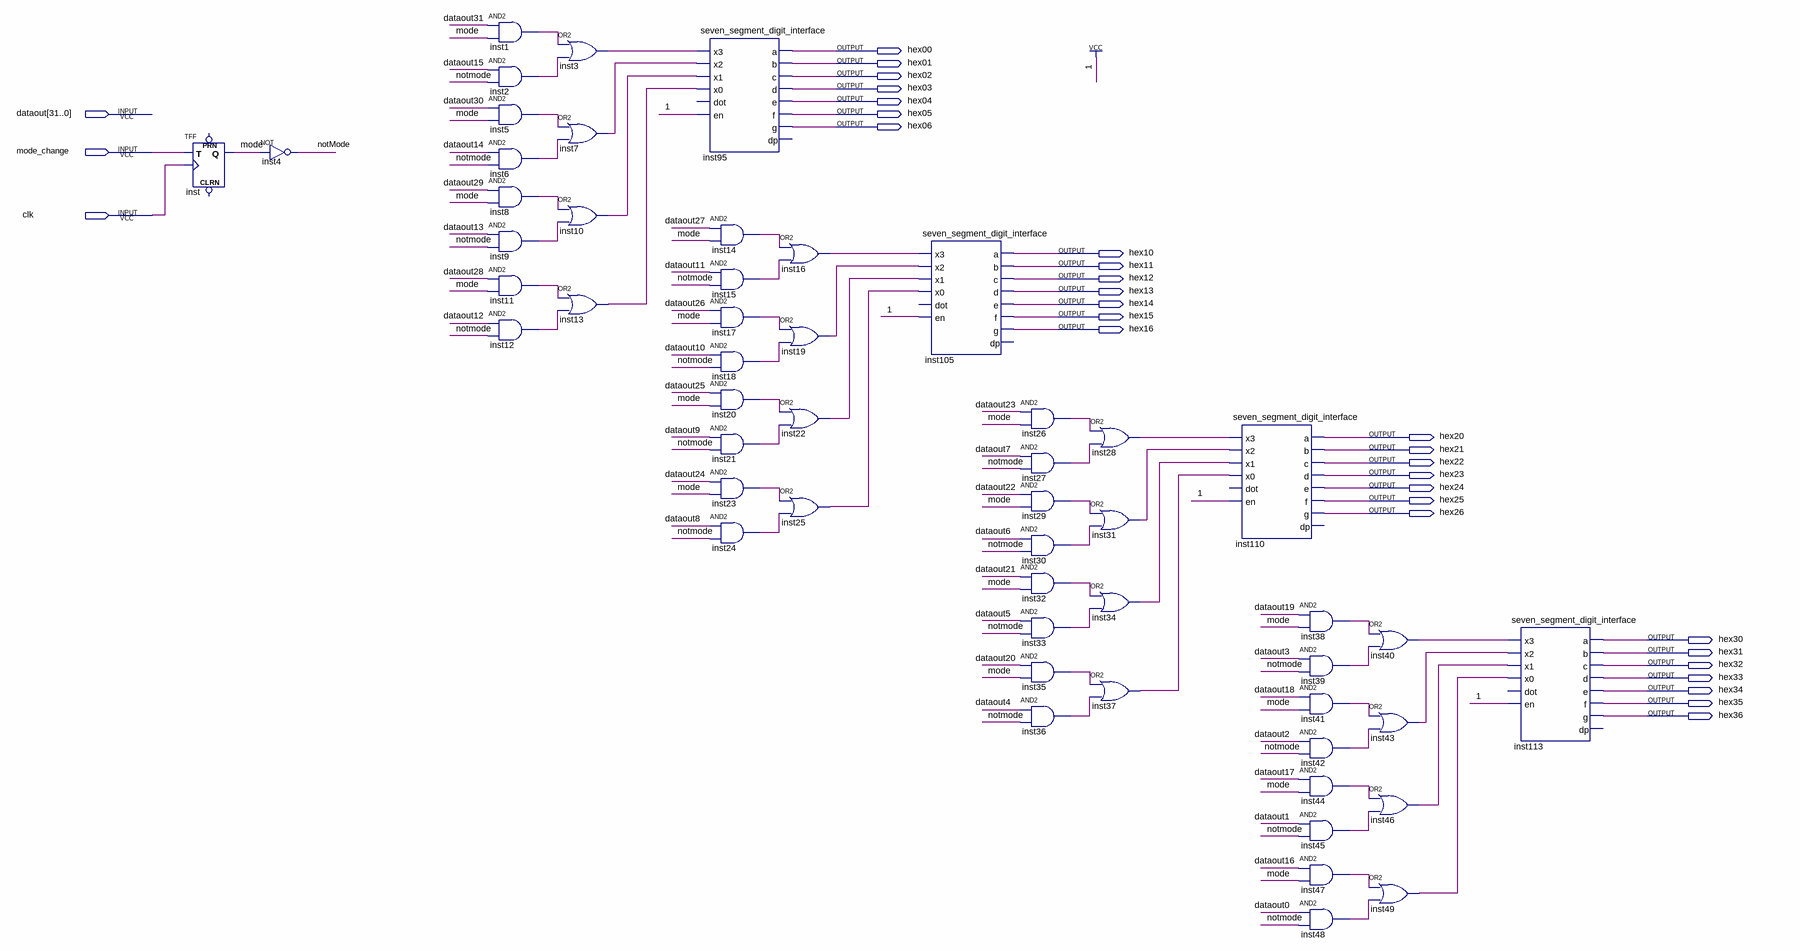
[diagram p0: schematic sheet]
// Quartus schematic Print.bdf as structural Verilog: 54 symbols, 31 pins
module Print (
  input  [31:0] dataout,
  input  mode_change,
  input  clk,
  output hex00,
  output hex01,
  output hex02,
  output hex03,
  output hex04,
  output hex05,
  output hex06,
  output hex10,
  output hex11,
  output hex12,
  output hex13,
  output hex14,
  output hex15,
  output hex16,
  output hex20,
  output hex21,
  output hex22,
  output hex23,
  output hex24,
  output hex25,
  output hex26,
  output hex30,
  output hex31,
  output hex32,
  output hex33,
  output hex34,
  output hex35,
  output hex36
);

  wire inst1_out, inst2_out, inst3_out, inst5_out, inst6_out, inst7_out, inst8_out, inst9_out, inst10_out,
       inst11_out, inst12_out, inst13_out, inst14_out, inst15_out, inst16_out, inst17_out, inst18_out,
       inst19_out, inst20_out, inst21_out, inst22_out, inst23_out, inst24_out, inst25_out, inst26_out,
       inst27_out, inst28_out, inst29_out, inst30_out, inst31_out, inst32_out, inst33_out, inst34_out,
       inst35_out, inst36_out, inst37_out, inst38_out, inst39_out, inst40_out, inst41_out, inst42_out,
       inst43_out, inst44_out, inst45_out, inst46_out, inst47_out, inst48_out, inst49_out, mode, notMode;

  TFF inst (.T(mode_change), .CLK(clk), .Q(mode));  // open: PRN, CLRN
  not inst4 (notMode, mode);
  and inst1 (inst1_out, dataout[31], mode);
  and inst2 (inst2_out, dataout[15], notMode);
  and inst5 (inst5_out, dataout[30], mode);
  and inst6 (inst6_out, dataout[14], notMode);
  and inst8 (inst8_out, dataout[29], mode);
  and inst9 (inst9_out, dataout[13], notMode);
  and inst11 (inst11_out, dataout[28], mode);
  and inst12 (inst12_out, dataout[12], notMode);
  or inst3 (inst3_out, inst1_out, inst2_out);
  or inst7 (inst7_out, inst5_out, inst6_out);
  or inst10 (inst10_out, inst8_out, inst9_out);
  or inst13 (inst13_out, inst11_out, inst12_out);
  seven_segment_digit_interface inst95 (
    .x3(inst3_out), .x2(inst7_out), .x1(inst10_out), .x0(inst13_out), .en(1'b1), .a(hex00), .b(hex01),
    .c(hex02), .d(hex03), .e(hex04), .f(hex05), .g(hex06));  // open: dot, dp
  and inst14 (inst14_out, dataout[27], mode);
  and inst15 (inst15_out, dataout[11], notMode);
  and inst17 (inst17_out, dataout[26], mode);
  and inst18 (inst18_out, dataout[10], notMode);
  and inst20 (inst20_out, dataout[25], mode);
  and inst21 (inst21_out, dataout[9], notMode);
  and inst23 (inst23_out, dataout[24], mode);
  and inst24 (inst24_out, dataout[8], notMode);
  or inst16 (inst16_out, inst14_out, inst15_out);
  or inst19 (inst19_out, inst17_out, inst18_out);
  or inst22 (inst22_out, inst20_out, inst21_out);
  or inst25 (inst25_out, inst23_out, inst24_out);
  seven_segment_digit_interface inst105 (
    .x3(inst16_out), .x2(inst19_out), .x1(inst22_out), .x0(inst25_out), .en(1'b1), .a(hex10), .b(hex11),
    .c(hex12), .d(hex13), .e(hex14), .f(hex15), .g(hex16));  // open: dot, dp
  and inst26 (inst26_out, dataout[23], mode);
  and inst27 (inst27_out, dataout[7], notMode);
  and inst29 (inst29_out, dataout[22], mode);
  and inst30 (inst30_out, dataout[6], notMode);
  and inst32 (inst32_out, dataout[21], mode);
  and inst33 (inst33_out, dataout[5], notMode);
  and inst35 (inst35_out, dataout[20], mode);
  and inst36 (inst36_out, dataout[4], notMode);
  or inst28 (inst28_out, inst26_out, inst27_out);
  or inst31 (inst31_out, inst29_out, inst30_out);
  or inst34 (inst34_out, inst32_out, inst33_out);
  or inst37 (inst37_out, inst35_out, inst36_out);
  seven_segment_digit_interface inst110 (
    .x3(inst28_out), .x2(inst31_out), .x1(inst34_out), .x0(inst37_out), .en(1'b1), .a(hex20), .b(hex21),
    .c(hex22), .d(hex23), .e(hex24), .f(hex25), .g(hex26));  // open: dot, dp
  and inst38 (inst38_out, dataout[19], mode);
  and inst39 (inst39_out, dataout[3], notMode);
  and inst41 (inst41_out, dataout[18], mode);
  and inst42 (inst42_out, dataout[2], notMode);
  and inst44 (inst44_out, dataout[17], mode);
  and inst45 (inst45_out, dataout[1], notMode);
  and inst47 (inst47_out, dataout[16], mode);
  and inst48 (inst48_out, dataout[0], notMode);
  or inst40 (inst40_out, inst38_out, inst39_out);
  or inst43 (inst43_out, inst41_out, inst42_out);
  or inst46 (inst46_out, inst44_out, inst45_out);
  or inst49 (inst49_out, inst47_out, inst48_out);
  seven_segment_digit_interface inst113 (
    .x3(inst40_out), .x2(inst43_out), .x1(inst46_out), .x0(inst49_out), .en(1'b1), .a(hex30), .b(hex31),
    .c(hex32), .d(hex33), .e(hex34), .f(hex35), .g(hex36));  // open: dot, dp
endmodule
